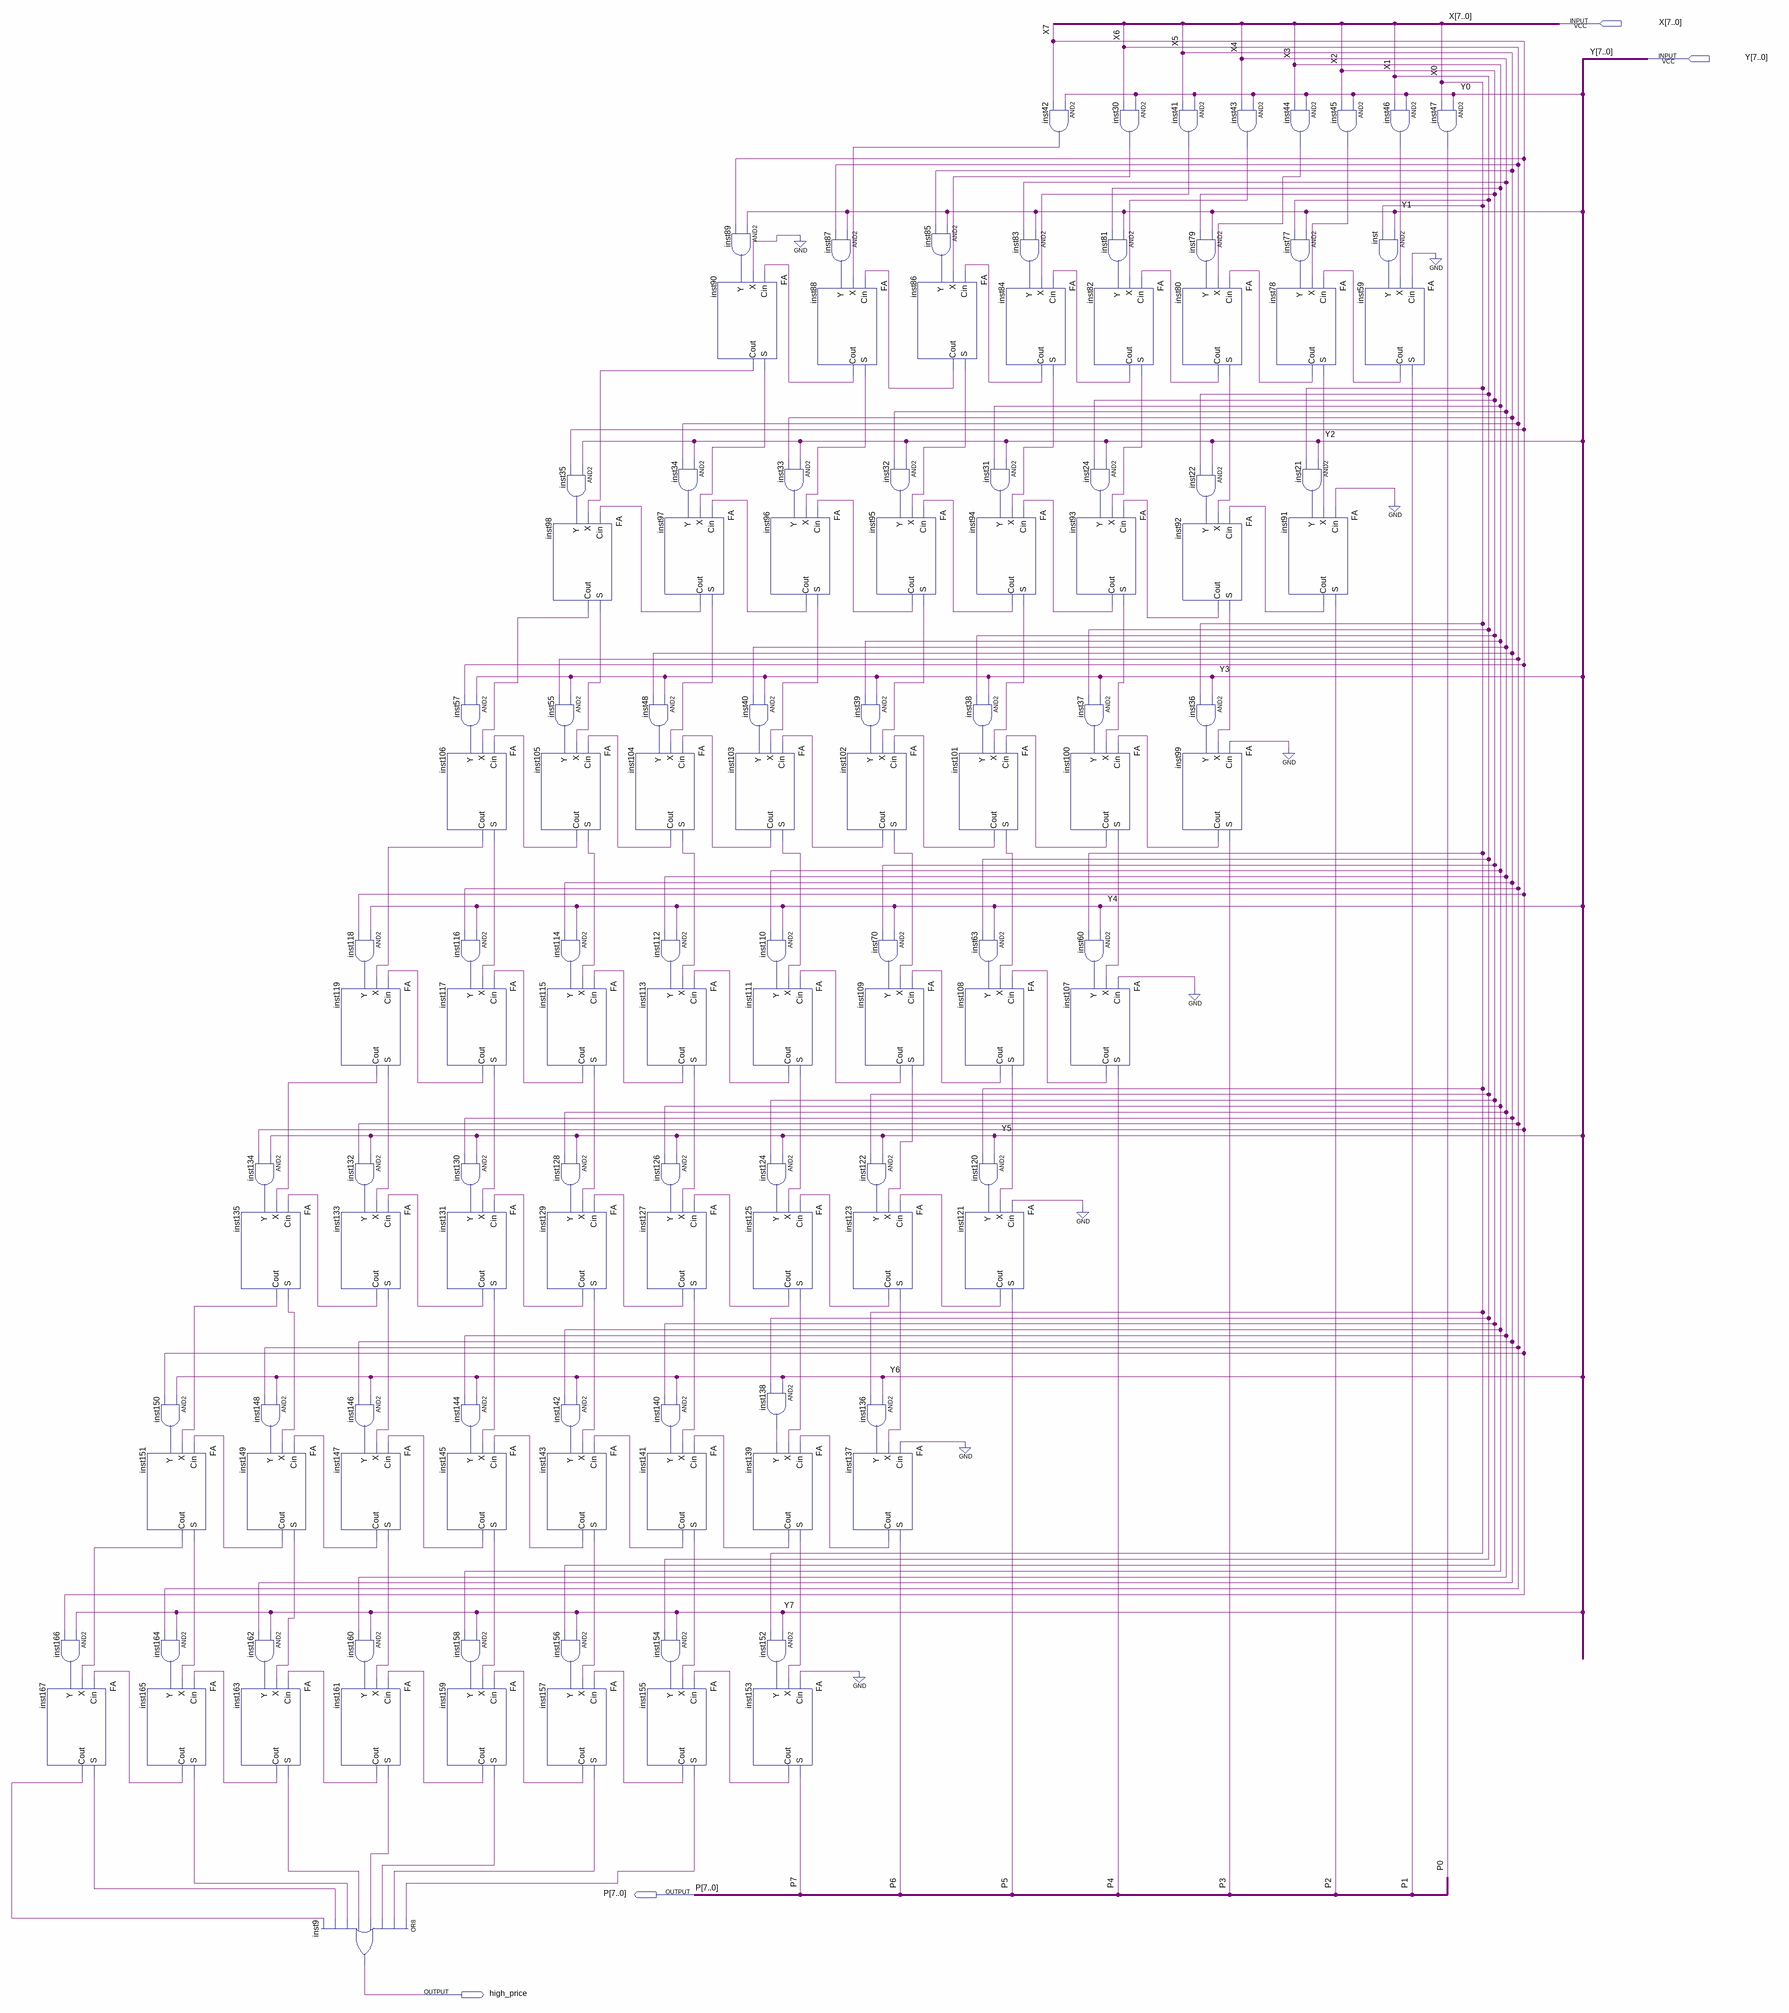
[diagram p0: schematic sheet]
// Quartus schematic 8bit_multiplier.bdf as structural Verilog: 121 symbols, 4 pins
module \8bit_multiplier  (
  input  [7:0] X,
  input  [7:0] Y,
  output [7:0] P,
  output high_price
);

  wire inst21_out, inst22_out, inst24_out, inst30_out, inst31_out, inst32_out, inst33_out, inst34_out,
       inst35_out, inst36_out, inst37_out, inst38_out, inst39_out, inst40_out, inst41_out, inst42_out,
       inst43_out, inst44_out, inst45_out, inst46_out, inst48_out, inst55_out, inst57_out, inst59_cout,
       inst60_out, inst63_out, inst70_out, inst77_out, inst78_cout, inst78_s, inst79_out, inst80_cout,
       inst80_s, inst81_out, inst82_cout, inst82_s, inst83_out, inst84_cout, inst84_s, inst85_out,
       inst86_cout, inst86_s, inst87_out, inst88_cout, inst88_s, inst89_out, inst90_cout, inst90_s,
       inst91_cout, inst92_cout, inst92_s, inst93_cout, inst93_s, inst94_cout, inst94_s, inst95_cout,
       inst95_s, inst96_cout, inst96_s, inst97_cout, inst97_s, inst98_cout, inst98_s, inst99_cout,
       inst100_cout, inst100_s, inst101_cout, inst101_s, inst102_cout, inst102_s, inst103_cout, inst103_s,
       inst104_cout, inst104_s, inst105_cout, inst105_s, inst106_cout, inst106_s, inst107_cout, inst108_cout,
       inst108_s, inst109_cout, inst109_s, inst110_out, inst111_cout, inst111_s, inst112_out, inst113_cout,
       inst113_s, inst114_out, inst115_cout, inst115_s, inst116_out, inst117_cout, inst117_s, inst118_out,
       inst119_cout, inst119_s, inst120_out, inst121_cout, inst122_out, inst123_cout, inst123_s, inst124_out,
       inst125_cout, inst125_s, inst126_out, inst127_cout, inst127_s, inst128_out, inst129_cout, inst129_s,
       inst130_out, inst131_cout, inst131_s, inst132_out, inst133_cout, inst133_s, inst134_out, inst135_cout,
       inst135_s, inst136_out, inst137_cout, inst138_out, inst139_cout, inst139_s, inst140_out, inst141_cout,
       inst141_s, inst142_out, inst143_cout, inst143_s, inst144_out, inst145_cout, inst145_s, inst146_out,
       inst147_cout, inst147_s, inst148_out, inst149_cout, inst149_s, inst150_out, inst151_cout, inst151_s,
       inst152_out, inst153_cout, inst154_out, inst155_cout, inst155_s, inst156_out, inst157_cout, inst157_s,
       inst158_out, inst159_cout, inst159_s, inst160_out, inst161_cout, inst161_s, inst162_out, inst163_cout,
       inst163_s, inst164_out, inst165_cout, inst165_s, inst166_out, inst167_cout, inst167_s, inst_out;

  FA inst167 (.Cin(inst165_cout), .X(inst151_cout), .Y(inst166_out), .S(inst167_s), .Cout(inst167_cout));
  and inst166 (inst166_out, Y[7], X[7]);
  FA inst151 (.Cin(inst149_cout), .X(inst135_cout), .Y(inst150_out), .S(inst151_s), .Cout(inst151_cout));
  FA inst165 (.Cin(inst163_cout), .X(inst151_s), .Y(inst164_out), .S(inst165_s), .Cout(inst165_cout));
  and inst150 (inst150_out, Y[6], X[7]);
  and inst164 (inst164_out, Y[7], X[6]);
  FA inst135 (.Cin(inst133_cout), .X(inst119_cout), .Y(inst134_out), .S(inst135_s), .Cout(inst135_cout));
  FA inst149 (.Cin(inst147_cout), .X(inst135_s), .Y(inst148_out), .S(inst149_s), .Cout(inst149_cout));
  FA inst163 (.Cin(inst161_cout), .X(inst149_s), .Y(inst162_out), .S(inst163_s), .Cout(inst163_cout));
  and inst134 (inst134_out, Y[5], X[7]);
  and inst148 (inst148_out, Y[6], X[6]);
  and inst162 (inst162_out, Y[7], X[5]);
  FA inst119 (.Cin(inst117_cout), .X(inst106_cout), .Y(inst118_out), .S(inst119_s), .Cout(inst119_cout));
  FA inst133 (.Cin(inst131_cout), .X(inst119_s), .Y(inst132_out), .S(inst133_s), .Cout(inst133_cout));
  FA inst147 (.Cin(inst145_cout), .X(inst133_s), .Y(inst146_out), .S(inst147_s), .Cout(inst147_cout));
  FA inst161 (.Cin(inst159_cout), .X(inst147_s), .Y(inst160_out), .S(inst161_s), .Cout(inst161_cout));
  or inst9 (high_price, inst155_s, inst157_s, inst159_s, inst161_s, inst163_s, inst165_s, inst167_s, inst167_cout);
  and inst118 (inst118_out, Y[4], X[7]);
  and inst132 (inst132_out, Y[5], X[6]);
  and inst146 (inst146_out, Y[6], X[5]);
  and inst160 (inst160_out, Y[7], X[4]);
  and inst57 (inst57_out, Y[3], X[7]);
  FA inst106 (.Cin(inst105_cout), .X(inst98_cout), .Y(inst57_out), .S(inst106_s), .Cout(inst106_cout));
  and inst116 (inst116_out, Y[4], X[6]);
  FA inst117 (.Cin(inst115_cout), .X(inst106_s), .Y(inst116_out), .S(inst117_s), .Cout(inst117_cout));
  and inst130 (inst130_out, Y[5], X[5]);
  FA inst131 (.Cin(inst129_cout), .X(inst117_s), .Y(inst130_out), .S(inst131_s), .Cout(inst131_cout));
  and inst144 (inst144_out, Y[6], X[4]);
  FA inst145 (.Cin(inst143_cout), .X(inst131_s), .Y(inst144_out), .S(inst145_s), .Cout(inst145_cout));
  and inst158 (inst158_out, Y[7], X[3]);
  FA inst159 (.Cin(inst157_cout), .X(inst145_s), .Y(inst158_out), .S(inst159_s), .Cout(inst159_cout));
  and inst35 (inst35_out, Y[2], X[7]);
  FA inst98 (.Cin(inst97_cout), .X(inst90_cout), .Y(inst35_out), .S(inst98_s), .Cout(inst98_cout));
  and inst55 (inst55_out, Y[3], X[6]);
  FA inst105 (.Cin(inst104_cout), .X(inst98_s), .Y(inst55_out), .S(inst105_s), .Cout(inst105_cout));
  and inst114 (inst114_out, Y[4], X[5]);
  FA inst115 (.Cin(inst113_cout), .X(inst105_s), .Y(inst114_out), .S(inst115_s), .Cout(inst115_cout));
  and inst128 (inst128_out, Y[5], X[4]);
  FA inst129 (.Cin(inst127_cout), .X(inst115_s), .Y(inst128_out), .S(inst129_s), .Cout(inst129_cout));
  and inst142 (inst142_out, Y[6], X[3]);
  FA inst143 (.Cin(inst141_cout), .X(inst129_s), .Y(inst142_out), .S(inst143_s), .Cout(inst143_cout));
  and inst156 (inst156_out, Y[7], X[2]);
  FA inst157 (.Cin(inst155_cout), .X(inst143_s), .Y(inst156_out), .S(inst157_s), .Cout(inst157_cout));
  FA inst97 (.Cin(inst96_cout), .X(inst90_s), .Y(inst34_out), .S(inst97_s), .Cout(inst97_cout));
  and inst48 (inst48_out, Y[3], X[5]);
  FA inst104 (.Cin(inst103_cout), .X(inst97_s), .Y(inst48_out), .S(inst104_s), .Cout(inst104_cout));
  and inst112 (inst112_out, Y[4], X[4]);
  FA inst113 (.Cin(inst111_cout), .X(inst104_s), .Y(inst112_out), .S(inst113_s), .Cout(inst113_cout));
  and inst126 (inst126_out, Y[5], X[3]);
  FA inst127 (.Cin(inst125_cout), .X(inst113_s), .Y(inst126_out), .S(inst127_s), .Cout(inst127_cout));
  and inst140 (inst140_out, Y[6], X[2]);
  FA inst141 (.Cin(inst139_cout), .X(inst127_s), .Y(inst140_out), .S(inst141_s), .Cout(inst141_cout));
  and inst154 (inst154_out, Y[7], X[1]);
  FA inst155 (.Cin(inst153_cout), .X(inst141_s), .Y(inst154_out), .S(inst155_s), .Cout(inst155_cout));
  FA inst90 (.Cin(inst88_cout), .X(1'b0), .Y(inst89_out), .S(inst90_s), .Cout(inst90_cout));
  and inst34 (inst34_out, Y[2], X[6]);
  and inst89 (inst89_out, Y[1], X[7]);
  and inst40 (inst40_out, Y[3], X[4]);
  FA inst103 (.Cin(inst102_cout), .X(inst96_s), .Y(inst40_out), .S(inst103_s), .Cout(inst103_cout));
  FA inst111 (.Cin(inst109_cout), .X(inst103_s), .Y(inst110_out), .S(inst111_s), .Cout(inst111_cout));
  FA inst125 (.Cin(inst123_cout), .X(inst111_s), .Y(inst124_out), .S(inst125_s), .Cout(inst125_cout));
  FA inst139 (.Cin(inst137_cout), .X(inst125_s), .Y(inst138_out), .S(inst139_s), .Cout(inst139_cout));
  FA inst153 (.Cin(1'b0), .X(inst139_s), .Y(inst152_out), .S(P[7]), .Cout(inst153_cout));
  and inst33 (inst33_out, Y[2], X[5]);
  FA inst96 (.Cin(inst95_cout), .X(inst88_s), .Y(inst33_out), .S(inst96_s), .Cout(inst96_cout));
  and inst110 (inst110_out, Y[4], X[3]);
  and inst124 (inst124_out, Y[5], X[2]);
  and inst138 (inst138_out, Y[6], X[1]);
  and inst152 (inst152_out, Y[7], X[0]);
  and inst87 (inst87_out, Y[1], X[6]);
  FA inst88 (.Cin(inst86_cout), .X(inst42_out), .Y(inst87_out), .S(inst88_s), .Cout(inst88_cout));
  FA inst102 (.Cin(inst101_cout), .X(inst95_s), .Y(inst39_out), .S(inst102_s), .Cout(inst102_cout));
  FA inst123 (.Cin(inst121_cout), .X(inst109_s), .Y(inst122_out), .S(inst123_s), .Cout(inst123_cout));
  FA inst137 (.Cin(1'b0), .X(inst123_s), .Y(inst136_out), .S(P[6]), .Cout(inst137_cout));
  and inst32 (inst32_out, Y[2], X[4]);
  FA inst95 (.Cin(inst94_cout), .X(inst86_s), .Y(inst32_out), .S(inst95_s), .Cout(inst95_cout));
  and inst39 (inst39_out, Y[3], X[3]);
  and inst70 (inst70_out, Y[4], X[2]);
  FA inst109 (.Cin(inst108_cout), .X(inst102_s), .Y(inst70_out), .S(inst109_s), .Cout(inst109_cout));
  and inst122 (inst122_out, Y[5], X[1]);
  and inst136 (inst136_out, Y[6], X[0]);
  and inst85 (inst85_out, Y[1], X[5]);
  FA inst86 (.Cin(inst84_cout), .X(inst30_out), .Y(inst85_out), .S(inst86_s), .Cout(inst86_cout));
  and inst31 (inst31_out, Y[2], X[3]);
  FA inst94 (.Cin(inst93_cout), .X(inst84_s), .Y(inst31_out), .S(inst94_s), .Cout(inst94_cout));
  and inst38 (inst38_out, Y[3], X[2]);
  FA inst101 (.Cin(inst100_cout), .X(inst94_s), .Y(inst38_out), .S(inst101_s), .Cout(inst101_cout));
  and inst63 (inst63_out, Y[4], X[1]);
  FA inst108 (.Cin(inst107_cout), .X(inst101_s), .Y(inst63_out), .S(inst108_s), .Cout(inst108_cout));
  and inst120 (inst120_out, Y[5], X[0]);
  FA inst121 (.Cin(1'b0), .X(inst108_s), .Y(inst120_out), .S(P[5]), .Cout(inst121_cout));
  and inst83 (inst83_out, Y[1], X[4]);
  FA inst84 (.Cin(inst82_cout), .X(inst41_out), .Y(inst83_out), .S(inst84_s), .Cout(inst84_cout));
  and inst42 (inst42_out, Y[0], X[7]);
  FA inst82 (.Cin(inst80_cout), .X(inst43_out), .Y(inst81_out), .S(inst82_s), .Cout(inst82_cout));
  and inst24 (inst24_out, Y[2], X[2]);
  FA inst93 (.Cin(inst92_cout), .X(inst82_s), .Y(inst24_out), .S(inst93_s), .Cout(inst93_cout));
  and inst37 (inst37_out, Y[3], X[1]);
  FA inst100 (.Cin(inst99_cout), .X(inst93_s), .Y(inst37_out), .S(inst100_s), .Cout(inst100_cout));
  and inst60 (inst60_out, Y[4], X[0]);
  FA inst107 (.Cin(1'b0), .X(inst100_s), .Y(inst60_out), .S(P[4]), .Cout(inst107_cout));
  and inst30 (inst30_out, Y[0], X[6]);
  and inst81 (inst81_out, Y[1], X[3]);
  and inst41 (inst41_out, Y[0], X[5]);
  FA inst80 (.Cin(inst78_cout), .X(inst44_out), .Y(inst79_out), .S(inst80_s), .Cout(inst80_cout));
  FA inst92 (.Cin(inst91_cout), .X(inst80_s), .Y(inst22_out), .S(inst92_s), .Cout(inst92_cout));
  FA inst99 (.Cin(1'b0), .X(inst92_s), .Y(inst36_out), .S(P[3]), .Cout(inst99_cout));
  and inst79 (inst79_out, Y[1], X[2]);
  and inst22 (inst22_out, Y[2], X[1]);
  and inst36 (inst36_out, Y[3], X[0]);
  and inst43 (inst43_out, Y[0], X[4]);
  FA inst78 (.Cin(inst59_cout), .X(inst45_out), .Y(inst77_out), .S(inst78_s), .Cout(inst78_cout));
  and inst44 (inst44_out, Y[0], X[3]);
  and inst77 (inst77_out, Y[1], X[1]);
  and inst21 (inst21_out, Y[2], X[0]);
  FA inst91 (.Cin(1'b0), .X(inst78_s), .Y(inst21_out), .S(P[2]), .Cout(inst91_cout));
  and inst45 (inst45_out, Y[0], X[2]);
  FA inst59 (.Cin(1'b0), .X(inst46_out), .Y(inst_out), .S(P[1]), .Cout(inst59_cout));
  and inst46 (inst46_out, Y[0], X[1]);
  and inst (inst_out, Y[1], X[0]);
  and inst47 (P[0], Y[0], X[0]);
endmodule
